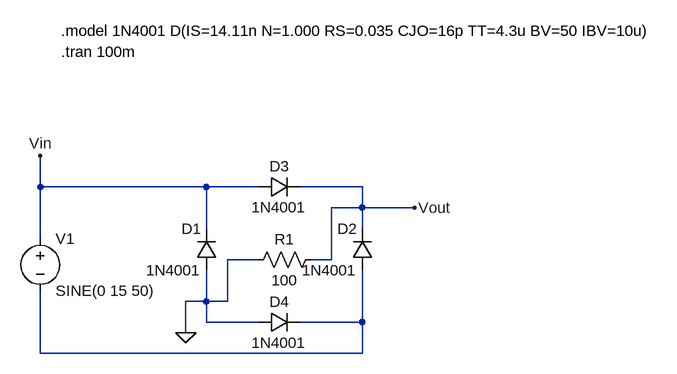
[diagram p0: schematic Draft5.asc]
Draft5.asc, the LTspice schematic file:
Version 4.1
SHEET 1 1124 680
WIRE 96 16 96 -32
WIRE 352 16 96 16
WIRE 432 16 352 16
WIRE 592 16 496 16
WIRE 592 48 592 16
WIRE 592 48 544 48
WIRE 672 48 592 48
WIRE 352 80 352 16
WIRE 592 80 592 48
WIRE 96 96 96 16
WIRE 432 128 384 128
WIRE 544 128 544 48
WIRE 544 128 512 128
WIRE 352 192 352 144
WIRE 352 192 320 192
WIRE 384 192 384 128
WIRE 384 192 352 192
WIRE 352 224 352 192
WIRE 432 224 352 224
WIRE 592 224 592 144
WIRE 592 224 496 224
WIRE 320 240 320 192
WIRE 96 272 96 176
WIRE 592 272 592 224
WIRE 592 272 96 272
FLAG 96 -32 Vin
FLAG 672 48 Vout
FLAG 320 240 0
SYMBOL diode 368 144 R180
WINDOW 0 24 64 Left 2
WINDOW 3 24 0 Left 2
SYMATTR InstName D1
SYMATTR Value 1N4001
SYMBOL diode 608 144 R180
WINDOW 0 24 64 Left 2
WINDOW 3 24 0 Left 2
SYMATTR InstName D2
SYMATTR Value 1N4001
SYMBOL diode 432 32 R270
WINDOW 0 32 32 VTop 2
WINDOW 3 0 32 VBottom 2
SYMATTR InstName D3
SYMATTR Value 1N4001
SYMBOL diode 432 240 R270
WINDOW 0 32 32 VTop 2
WINDOW 3 0 32 VBottom 2
SYMATTR InstName D4
SYMATTR Value 1N4001
SYMBOL res 528 112 R90
WINDOW 0 0 56 VBottom 2
WINDOW 3 32 56 VTop 2
SYMATTR InstName R1
SYMATTR Value 100
SYMBOL voltage 96 80 R0
WINDOW 123 0 0 Left 0
WINDOW 39 0 0 Left 0
SYMATTR InstName V1
SYMATTR Value SINE(0 15 50)
TEXT 128 -224 Left 2 !.model 1N4001 D(IS=14.11n N=1.000 RS=0.035 CJO=16p TT=4.3u BV=50 IBV=10u)
TEXT 128 -192 Left 2 !.tran 100m

The netlist it stands for:
* Draft5.asc
D1 0 Vin 1N4001
D2 N001 Vout 1N4001
D3 Vin Vout 1N4001
D4 0 N001 1N4001
R1 Vout 0 100
V1 Vin N001 SINE(0 15 50)
.model D D
.lib standard.dio
.model 1N4001 D(IS=14.11n N=1.000 RS=0.035 CJO=16p TT=4.3u BV=50 IBV=10u)
.tran 100m
.backanno
.end